# EAGLE design HW2_1 (EAGLE 8.7.1)
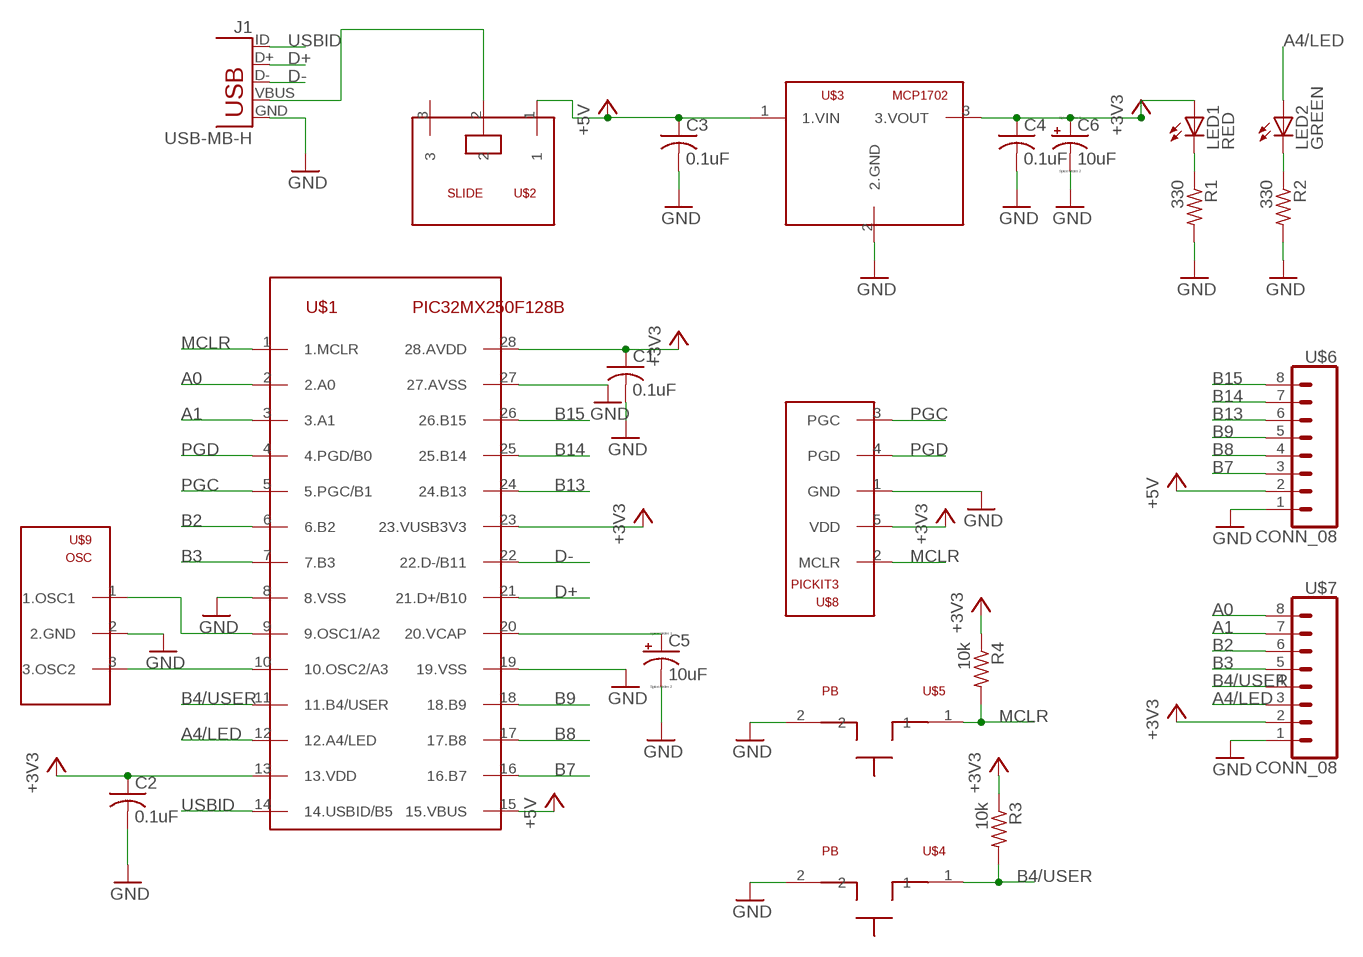
[diagram p0: schematic, sheet 1]

## Parts
C1  0.1uF  C-US025-025X050  [C025-025X050]
C2  0.1uF  C-US025-025X050  [C025-025X050]
C3  0.1uF  C-US025-025X050  [C025-025X050]
C4  0.1uF  C-US025-025X050  [C025-025X050]
C5  10uF  CPOL-USB45181B  [B45181B]
C6  10uF  CPOL-USB45181B  [B45181B]
J1  USB-MB-H  [USB-MB-H]
LED1  RED  LED3MM  [LED3MM]
LED2  GREEN  LED3MM  [LED3MM]
R1  330  R-US_0207/7  [0207/7]
R2  330  R-US_0207/7  [0207/7]
R3  10k  R-US_0207/7  [0207/7]
R4  10k  R-US_0207/7  [0207/7]
U$1  PIC32MX250F128B  [DIL28-3]
U$2  SLIDE  [SLIDE]
U$3  MCP1702  [TO92]
U$4  PB  [PB]
U$5  PB  [PB]
U$6  CONN_08  [1X08]
U$7  CONN_08  [1X08]
U$8  PICKIT3  [1X05]
U$9  OSC  [OSC]

## Nets
+3V3: C1.1 C2.1 C4.1 C6.+ LED1.A R3.1 R4.1 U$1.13(13.VDD) U$1.23(23.VUSB3V3) U$1.28(28.AVDD) U$3.3(3.VOUT) U$7.2 U$8.5(VDD)
+5V: C3.1 U$1.15(15.VBUS) U$2.1 U$3.1(1.VIN) U$6.2
A0: U$1.2(2.A0) U$7.8
A1: U$1.3(3.A1) U$7.7
A4/LED: LED2.A U$1.12(12.A4/LED) U$7.3
B2: U$1.6(6.B2) U$7.6
B3: U$1.7(7.B3) U$7.5
B4/USER: R3.2 U$1.11(11.B4/USER) U$4.1 U$7.4
B7: U$1.16(16.B7) U$6.3
B8: U$1.17(17.B8) U$6.4
B9: U$1.18(18.B9) U$6.5
B13: U$1.24(24.B13) U$6.6
B14: U$1.25(25.B14) U$6.7
B15: U$1.26(26.B15) U$6.8
D+: J1.D+ U$1.21(21.D+/B10)
D-: J1.D- U$1.22(22.D-/B11)
GND: C1.2 C2.2 C3.2 C4.2 C5.- C6.- J1.GND R1.2 R2.2 U$1.8(8.VSS) U$1.19(19.VSS) U$1.27(27.AVSS) U$3.2(2.GND) U$4.2 U$5.2 U$6.1 U$7.1 U$8.1(GND) U$9.2(2.GND)
MCLR: R4.2 U$1.1(1.MCLR) U$5.1 U$8.2(MCLR)
N$2: J1.VBUS U$2.2
N$4: LED1.K(C) R1.1
N$5: LED2.K(C) R2.1
N$6: U$1.10(10.OSC2/A3) U$9.3(3.OSC2)
N$7: U$1.9(9.OSC1/A2) U$9.1(1.OSC1)
N$8: C5.+ U$1.20(20.VCAP)
PGC: U$1.5(5.PGC/B1) U$8.3(PGC)
PGD: U$1.4(4.PGD/B0) U$8.4(PGD)
USBID: J1.ID U$1.14(14.USBID/B5)
Unconnected: U$2.3

## Library data of the parts
C1-C4 = ME433_LIB:C-US: CAPACITOR, American symbol
C5 C6 = ME433_LIB:CPOL-US: POLARIZED CAPACITOR, American symbol
J1 = ME433_LIB:USB: USB Connectors USB-B-PTH is fully proven SKU : PRT-00139/CONN-08278 USB-miniB is fully proven SKU : PRT-00587 USB-A-PCB is untested. USB-A-H is throughly reviewed, but untested. Spark Fun Electronics SKU : PRT-00437 USB-B-SMT is throughly reviewed, but untested. Needs silkscreen touching up. USB-A-S has not been used/tested USB-MB-H has not been used/tested USB-MICROB has been used. CONN-09505
LED1 LED2 = ME433_LIB:LED: LED OSRAM: - CHIPLED LG R971, LG N971, LY N971, LG Q971, LY Q971, LO R971, LY R971 LH N974, LH R974 LS Q976, LO Q976, LY Q976 LO Q996 - Hyper CHIPLED LW Q18S LB Q993, LB Q99A, LB R99A - SideLED LS A670, LO A670, LY A670, LG A670, LP A670 LB A673, LV A673, LT A673, LW A673 LH A674 LY A675 LS A676, LA A676, LO A676, LY A676, LW A676 LS A679, LY A679, LG A679 - Hyper Micro SIDELED® LS Y876, LA Y876, LO Y876, LY Y876 LT Y87S - SmartLED LW L88C, LW L88S LB L89C, LB L89S, LG L890 LS L89K, LO L89K, LY L89K LS L896, LA L896, LO L896, LY L896 - TOPLED LS T670, LO T670, LY T670, LG T670, LP T670 LSG T670, LSP T670, LSY T670, LOP T670, LYG T670 LG T671, LOG T671, LSG T671 LB T673, LV T673, LT T673, LW T673 LH T674 LS T676, LA T676, LO T676, LY T676, LB T676, LH T676, LSB T676, LW T676 LB T67C, LV T67C, LT T67C, LS T67K, LO T67K, LY T67K, LW E67C LS E67B, LA E67B, LO E67B, LY E67B, LB E67C, LV E67C, LT E67C LW T67C LS T679, LY T679, LG T679 LS T770, LO T770, LY T770, LG T770, LP T770 LB T773, LV T773, LT T773, LW T773 LH T774 LS E675, LA E675, LY E675, LS T675 LS T776, LA T776, LO T776, LY T776, LB T776 LHGB T686 LT T68C, LB T68C - Hyper Mini TOPLED® LB M676 - Mini TOPLED Santana® LG M470 LS M47K, LO M47K, LY M47K Source: http://www.osram.convergy.de LUXEON: - LUMILED® LXK2-PW12-R00, LXK2-PW12-S00, LXK2-PW14-U00, LXK2-PW14-V00 LXK2-PM12-R00, LXK2-PM12-S00, LXK2-PM14-U00 LXK2-PE12-Q00, LXK2-PE12-R00, LXK2-PE12-S00, LXK2-PE14-T00, LXK2-PE14-U00 LXK2-PB12-K00, LXK2-PB12-L00, LXK2-PB12-M00, LXK2-PB14-N00, LXK2-PB14-P00, LXK2-PB14-Q00 LXK2-PR12-L00, LXK2-PR12-M00, LXK2-PR14-Q00, LXK2-PR14-R00 LXK2-PD12-Q00, LXK2-PD12-R00, LXK2-PD12-S00 LXK2-PH12-R00, LXK2-PH12-S00 LXK2-PL12-P00, LXK2-PL12-Q00, LXK2-PL12-R00 Source: www.luxeon.com KINGBRIGHT: KA-3528ASYC Source: www.kingbright.com
R1-R4 = ME433_LIB:R-US_: RESISTOR, American symbol
U$1 = ME433_LIB:PIC32MX250F128B
U$2 = ME433_LIB:SLIDE
U$3 = ME433_LIB:MCP1702
U$4 U$5 = ME433_LIB:PB
U$6 U$7 = ME433_LIB:CONN_08
U$8 = ME433_LIB:PICKIT3
U$9 = ME433_LIB:OSC

## Board
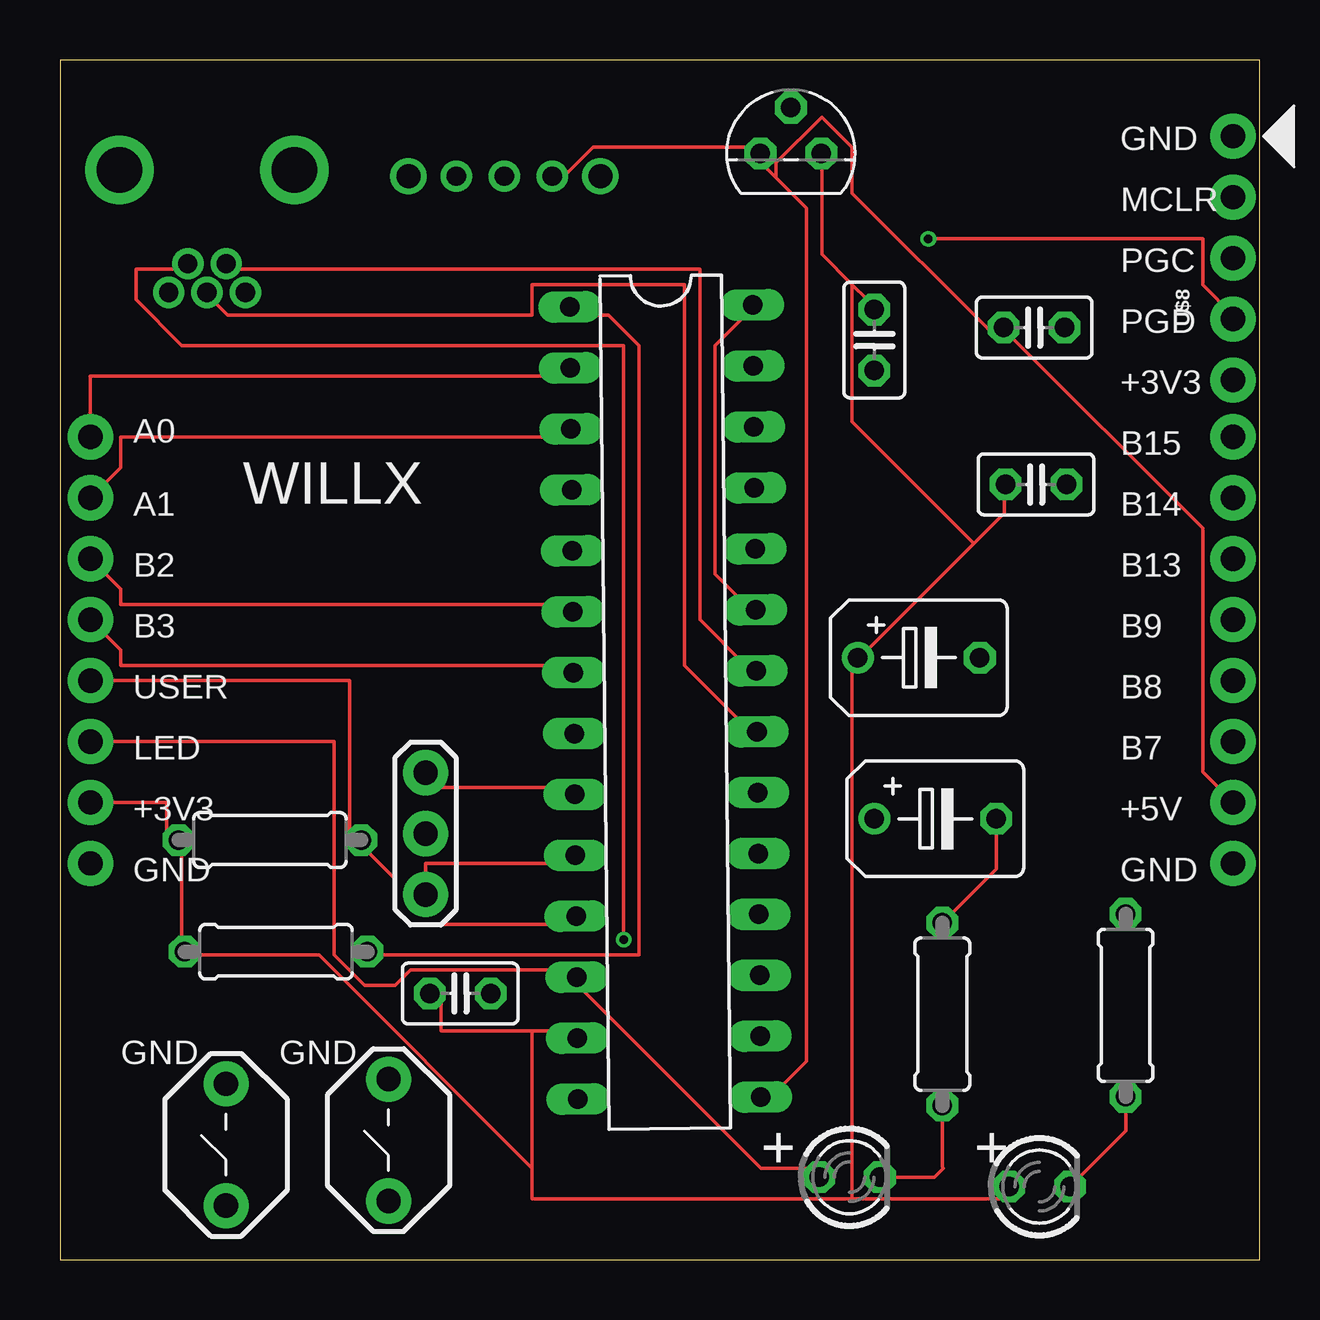
[diagram p1: board, top side]
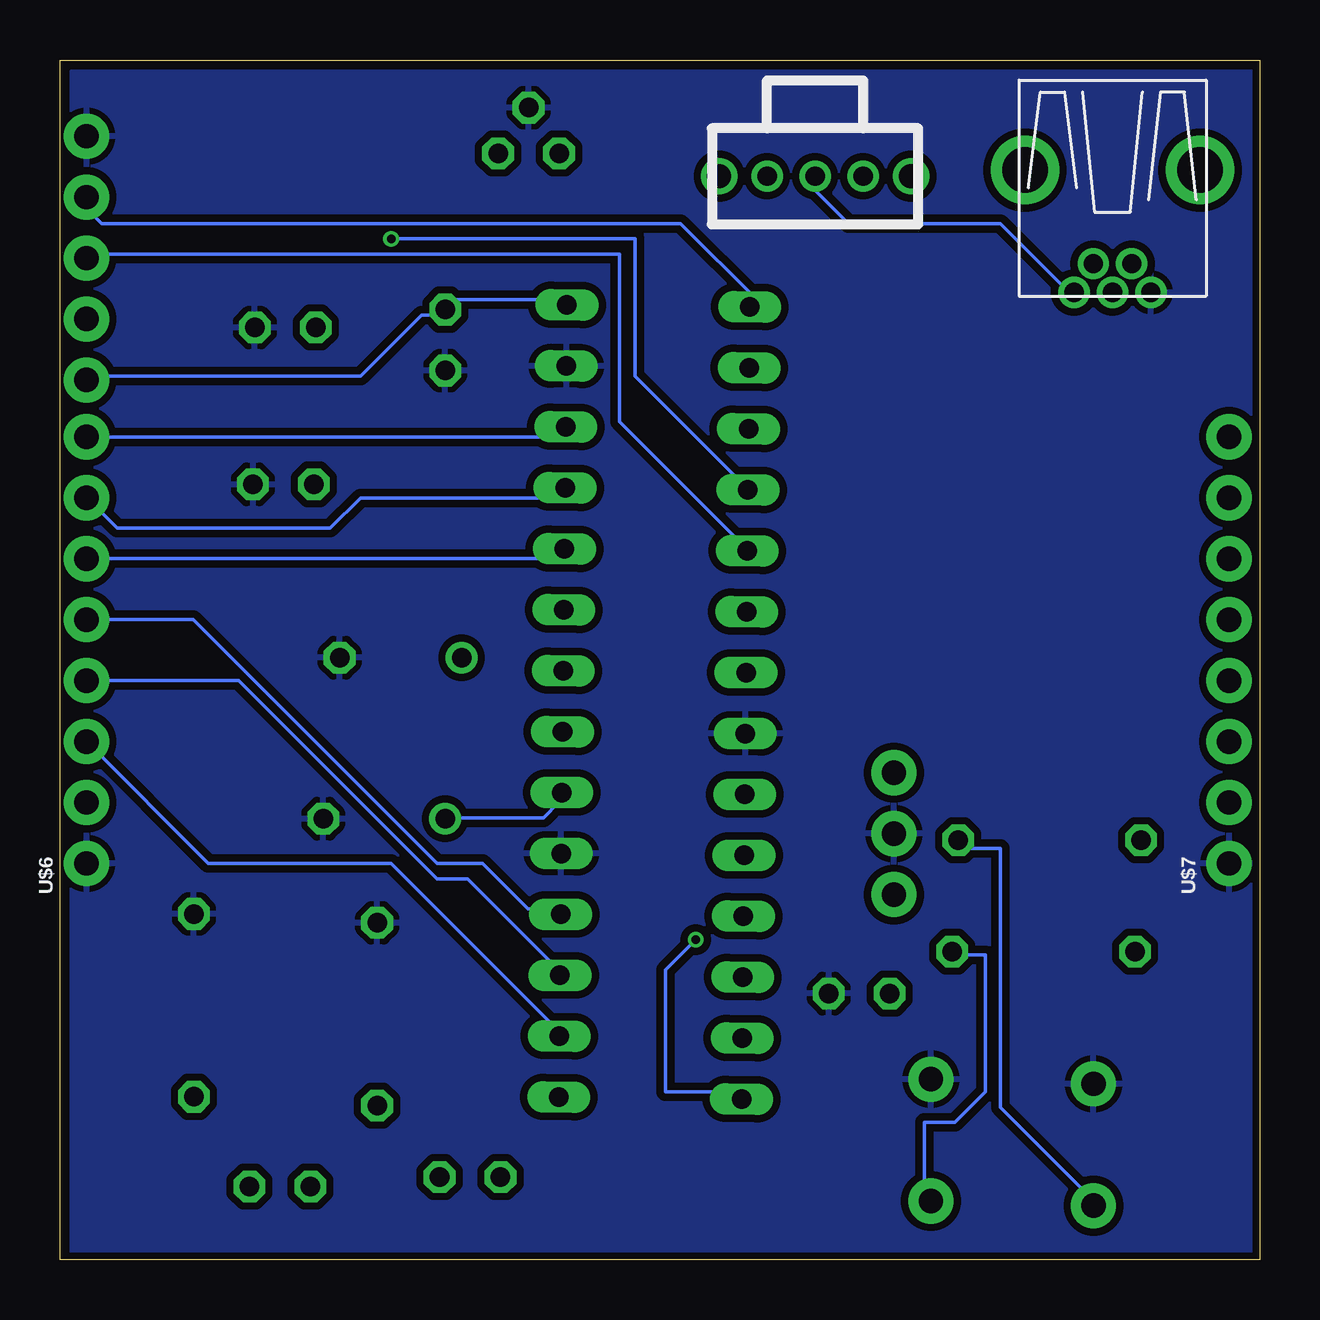
[diagram p2: board, bottom side, seen from below]

Size 50 x 50 mm. Coordinates in mm from the lower left corner, seen from the top.
Outline: 0,0 50,0 50,50 0,50 0,0
Copper layers (1*16): Top 0.035mm / dielectric 1.5mm / Bottom 0.035mm
Design rules "SeeedStudio_2layer_DRU_no_angle_20140221": minimum track width 6mil, minimum drill 12mil, track to track 6mil, track to pad 6mil, pad to pad 6mil, via to via 6mil, smd to smd 0mil, copper to edge 10mil, drill to drill 10mil, minimum pad ring 10mil, minimum via ring 6mil, stop-mask expansion 2mil, vias tented up to drill 100mil, thermal gap 10mil

### Footprints (pad centres in the part's own frame; a part is rotated, then mirrored left to right if it is on the bottom)
C025-025X050 = drill 0.813 octagon: 1 -1.27,0; 2 1.27,0
B45181B = drill 0.813: + -2.54,0 | drill 0.813 octagon: - 2.54,0
USB-MB-H = drill 0.8: D+ 5.1,0; D- 3.9,0.8; GND 5.1,-1.6; ID 3.9,-0.8; VBUS 5.1,1.6 | drill 1.9: P$6 0,-3.65; P$7 0,3.65
LED3MM = drill 0.813 octagon: A -1.27,0; K 1.27,0
0207/7 = drill 0.813 octagon: 1 -3.81,0; 2 3.81,0
DIL28-3 = drill 0.813 long: 1 -16.51,-3.81; 2 -13.97,-3.81; 3 -11.43,-3.81; 4 -8.89,-3.81; 5 -6.35,-3.81; 6 -3.81,-3.81; 7 -1.27,-3.81; 8 1.27,-3.81; 9 3.81,-3.81; 10 6.35,-3.81; 11 8.89,-3.81; 12 11.43,-3.81; 13 13.97,-3.81; 14 16.51,-3.81; 15 16.51,3.81; 16 13.97,3.81; 17 11.43,3.81; 18 8.89,3.81; 19 6.35,3.81; 20 3.81,3.81; 21 1.27,3.81; 22 -1.27,3.81; 23 -3.81,3.81; 24 -6.35,3.81; 25 -8.89,3.81; 26 -11.43,3.81; 27 -13.97,3.81; 28 -16.51,3.81
SLIDE = drill 0.8: 1 -2,0; 2 0,0; 3 2,0 | drill 1: P$1 -4,0; P$2 4,0
TO92 = drill 0.813 octagon: 1 -1.27,0; 2 0,1.905; 3 1.27,0
PB = drill 1.016 pad 1.88: 1 -2.54,0; 2 2.54,0
1X08 = drill 1.016 pad 1.88: 1 0,0; 2 2.54,0; 3 5.08,0; 4 7.62,0; 5 10.16,0; 6 12.7,0; 7 15.24,0; 8 17.78,0
1X05 = drill 1.016 pad 1.88: 1 0,0; 2 2.54,0; 3 5.08,0; 4 7.62,0; 5 10.16,0
OSC = drill 1.016 pad 1.88: 1 -2.54,0; 2 0,0; 3 2.54,0

### Placement (x,y rotation side)
C1  33.94,38.33 270 top
C2  16.68,11.09 0 top
C3  40.61,38.85 0 top
C4  40.69,32.31 0 top
C5  36.49,18.37 0 top
C6  35.8,25.09 0 top
J1  6.13,45.41 270 top
LED1  40.83,3.04 0 top
LED2  32.91,3.43 0 top
R1  44.42,10.59 90 top
R2  36.78,10.23 90 top
R3  8.75,17.48 0 top
R4  9,12.83 0 top
U$1  25.23,23.24 270.6 top
U$2  18.52,45.16 0 bottom
U$3  30.47,46.11 0 top
U$4  6.92,4.78 90 top
U$5  13.7,4.98 90 top
U$6  48.9,16.51 90 bottom
U$7  1.27,16.51 90 bottom
U$8  48.9,46.82 270 top
U$9  15.24,17.75 270 top

### Tracks (layer width: path | path; a pad name or v marks a point on that pad's centre or on a via)
+3V3
  Top 0.152: 38.1,29.84 39.37,31.11 39.37,31.75 C4.1 | 38.1,29.84 33.66,25.4 C6.+ 33.02,24.77 33.02,2.54 | U$1.23 28.57,27.3 27.3,28.57 27.3,38.1 28.57,39.37 U$1.28 | 33.02,40.64 31.75,41.91 31.75,45.72 U$3.3 | 33.02,40.64 33.66,40.01 C1.1 | 38.1,29.84 33.02,34.92 33.02,40.64 | U$7.2 4.45,19.05 4.45,17.78 R3.1 5.08,17.14 5.08,13.34 R4.1 5.71,12.7 10.79,12.7 19.68,3.81 | 19.68,9.53 15.88,9.53 15.88,10.79 C2.1 | 19.68,9.53 20.95,9.53 U$1.13 | 33.02,2.54 19.68,2.54 19.68,3.81 | 33.02,2.54 39.37,2.54 LED1.A | 19.68,9.53 19.68,3.81
  Bottom 0.152: U$8.5 48.9,36.83 37.47,36.83 34.92,39.37 34.29,39.37 C1.1 33.66,40.01 29.21,40.01 U$1.28
+5V
  Top 0.152: U$6.2 47.62,20.32 47.62,30.48 39.37,38.73 C3.1 38.73,38.73 33.02,44.45 33.02,46.35 31.75,47.62 29.84,45.72 29.84,45.09 | U$2.1 20.95,45.09 22.23,46.35 28.57,46.35 U$3.1 29.21,45.72 29.84,45.09 | 29.84,45.09 31.11,43.81 31.11,8.26 29.84,6.99 U$1.15
A0
  Top 0.152: U$7.8 1.27,36.83 20.95,36.83 U$1.2
A1
  Top 0.152: U$7.7 2.54,33.02 2.54,34.29 20.95,34.29 U$1.3
A4/LED
  Top 0.152: LED2.A 31.11,3.81 29.21,3.81 21.59,11.43 U$1.12 20.95,12.06 14.61,12.06 13.97,11.43 12.7,11.43 11.43,12.7 11.43,21.59 U$7.3
B2
  Top 0.152: U$7.6 2.54,27.94 2.54,27.3 20.95,27.3 U$1.6
B3
  Top 0.152: U$7.5 2.54,25.4 2.54,24.77 20.95,24.77 U$1.7
B4/USER
  Top 0.152: U$1.11 20.95,13.97 14.61,13.97 13.97,14.61 13.97,15.88 12.7,17.14 R3.2 12.06,17.78 12.06,24.13 U$7.4
  Bottom 0.152: U$4.1 6.99,2.54 10.79,6.35 10.79,17.14 12.06,17.14 R3.2
B7
  Bottom 0.152: U$6.3 43.81,16.51 36.2,16.51 29.21,9.53 U$1.16
B8
  Bottom 0.152: U$6.4 42.55,24.13 34.29,15.88 33.02,15.88 29.21,12.06 U$1.17
B9
  Bottom 0.152: U$6.5 44.45,26.67 34.29,16.51 32.38,16.51 30.48,14.61 29.21,14.61 U$1.18
B13
  Bottom 0.152: U$6.6 29.21,29.21 U$1.24
B14
  Bottom 0.152: U$6.7 47.62,30.48 38.73,30.48 37.47,31.75 29.21,31.75 U$1.25
B15
  Bottom 0.152: U$6.8 29.21,34.29 U$1.26
D+
  Top 0.152: J1.D+ 6.35,40.01 6.99,39.37 19.68,39.37 19.68,40.64 26.04,40.64 26.04,24.77 28.57,22.23 U$1.21
D-
  Top 0.152: J1.D- 6.99,41.27 26.67,41.27 26.67,26.67 28.57,24.77 U$1.22
GND
  Top 0.152: R2.2 39.03,16.29 C5.-
  pour Bottom (isolate 0.305): 0,49.53 49.53,49.53 49.53,0 0,0
MCLR
  Top 0.152: R4.2 13.34,12.7 24.13,12.7 24.13,38.1 22.86,39.37 21.59,39.37 U$1.1
  Bottom 0.152: U$5.1 13.97,2.54 13.97,5.71 12.7,5.71 11.43,6.99 11.43,12.7 12.7,12.7 R4.2 | U$8.2 48.9,43.81 48.26,43.18 24.13,43.18 20.95,40.01 U$1.1
N$2
  Bottom 0.152: J1.VBUS 8.26,40.64 10.79,43.18 17.14,43.18 19.05,45.09 U$2.2
N$4
  Top 0.152: LED1.K 44.42,5.36 R1.1
N$5
  Top 0.152: LED2.K 36.45,3.43 36.83,3.81 36.78,3.86 R2.1
N$6
  Top 0.152: U$9.3 15.24,16.51 20.95,16.51 U$1.10
N$7
  Top 0.152: U$1.9 20.95,19.68 15.24,19.68 U$9.1
N$8
  Bottom 0.152: U$1.20 29.21,19.05 29.84,18.41 33.66,18.41 C5.+
PGC
  Bottom 0.152: U$1.5 21.59,29.84 26.67,34.92 26.67,41.91 48.9,41.91 U$8.3
PGD  (via drill 0.35)
  Top 0.152: v36.2,42.55 47.62,42.55 47.62,40.64 48.9,39.37 U$8.4
  Bottom 0.152: v36.2,42.55 26.04,42.55 26.04,36.83 21.59,32.38 U$1.4
USBID  (via drill 0.35)
  Top 0.152: v23.5,13.34 23.5,38.1 5.08,38.1 3.17,40.01 3.17,41.27 5.08,41.27 J1.ID
  Bottom 0.152: v23.5,13.34 24.77,12.06 24.77,6.99 22.23,6.99 U$1.14

### Text on the board
tPlace: GND | MCLR | PGC | PGD | +3V3 | A0 | B15 | A1 | WILLX | B14 | B2 | B13 | B3 | B9 | USER | B8 | LED | B7 | +3V3 | +5V | GND | GND | GND | GND | + | +